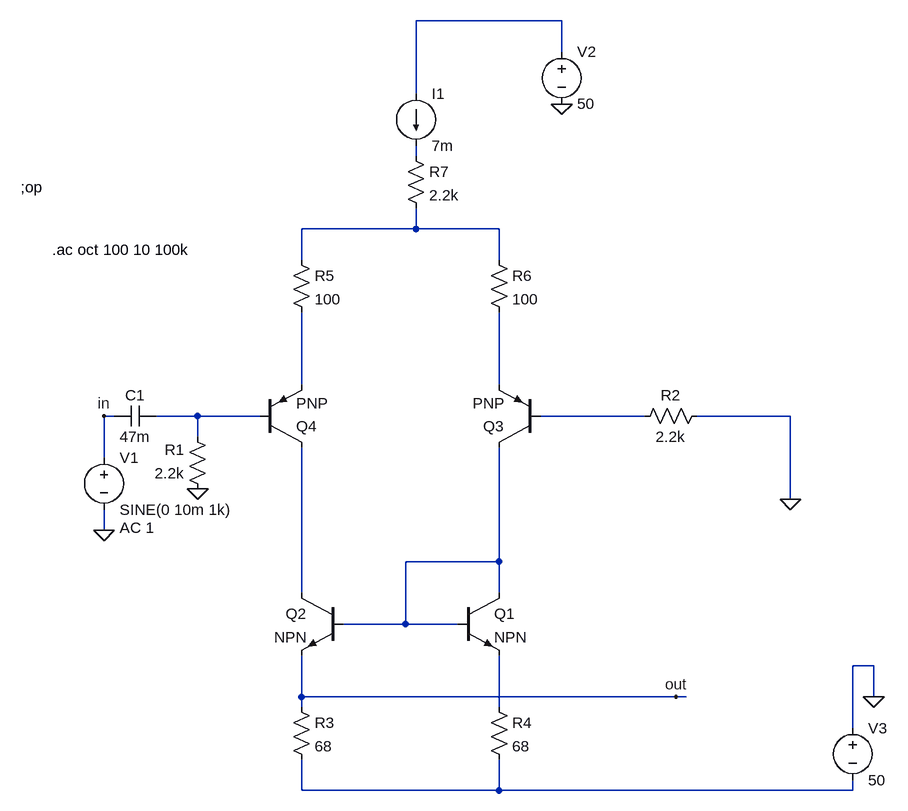
[diagram p0: schematic IPS.asc]
IPS.asc, the LTspice schematic file:
Version 4
SHEET 1 880 680
WIRE 352 -704 128 -704
WIRE 352 -656 352 -704
WIRE 128 -592 128 -704
WIRE 128 -496 128 -512
WIRE 128 -384 128 -416
WIRE 128 -384 -48 -384
WIRE 256 -384 128 -384
WIRE -48 -336 -48 -384
WIRE 256 -336 256 -384
WIRE -48 -144 -48 -256
WIRE 256 -144 256 -256
WIRE -336 -96 -352 -96
WIRE -208 -96 -272 -96
WIRE -112 -96 -208 -96
WIRE 480 -96 320 -96
WIRE 704 -96 560 -96
WIRE -208 -64 -208 -96
WIRE -352 -32 -352 -96
WIRE 704 32 704 -96
WIRE -352 80 -352 48
WIRE 256 128 256 -48
WIRE 256 128 112 128
WIRE -48 176 -48 -48
WIRE 256 176 256 128
WIRE 112 224 112 128
WIRE 112 224 16 224
WIRE 192 224 112 224
WIRE 832 288 800 288
WIRE -48 336 -48 272
WIRE 528 336 -48 336
WIRE 544 336 528 336
WIRE 832 336 832 288
WIRE -48 352 -48 336
WIRE 256 352 256 272
WIRE 800 384 800 288
WIRE -48 480 -48 432
WIRE 256 480 256 432
WIRE 256 480 -48 480
WIRE 800 480 800 464
WIRE 800 480 256 480
FLAG -352 80 0
FLAG 352 -576 0
FLAG 832 336 0
FLAG 704 32 0
FLAG -208 16 0
FLAG 528 336 out
FLAG -352 -96 in
SYMBOL npn 192 176 R0
SYMATTR InstName Q1
SYMBOL npn 16 176 M0
SYMATTR InstName Q2
SYMBOL res 576 -112 R90
WINDOW 0 0 56 VBottom 2
WINDOW 3 32 56 VTop 2
SYMATTR InstName R2
SYMATTR Value 2.2k
SYMBOL res -64 336 R0
SYMATTR InstName R3
SYMATTR Value 68
SYMBOL res 240 336 R0
SYMATTR InstName R4
SYMATTR Value 68
SYMBOL res -64 -352 R0
SYMATTR InstName R5
SYMATTR Value 100
SYMBOL res 240 -352 R0
SYMATTR InstName R6
SYMATTR Value 100
SYMBOL voltage -352 -48 R0
WINDOW 123 24 124 Left 2
WINDOW 39 0 0 Left 2
SYMATTR Value2 AC 1
SYMATTR InstName V1
SYMATTR Value SINE(0 10m 1k)
SYMBOL res 112 -512 R0
SYMATTR InstName R7
SYMATTR Value 2.2k
SYMBOL current 128 -592 R0
SYMATTR InstName I1
SYMATTR Value 7m
SYMBOL voltage 352 -672 R0
SYMATTR InstName V2
SYMATTR Value 50
SYMBOL voltage 800 368 R0
SYMATTR InstName V3
SYMATTR Value 50
SYMBOL res -192 32 R180
WINDOW 0 36 76 Left 2
WINDOW 3 36 40 Left 2
SYMATTR InstName R1
SYMATTR Value 2.2k
SYMBOL pnp 320 -48 R180
SYMATTR InstName Q3
SYMBOL pnp -112 -48 M180
SYMATTR InstName Q4
SYMBOL cap -272 -112 R90
WINDOW 0 0 32 VBottom 2
WINDOW 3 32 32 VTop 2
SYMATTR InstName C1
SYMATTR Value 47m
TEXT -480 -448 Left 2 !;op
TEXT -432 -352 Left 2 !.ac oct 100 10 100k

The netlist it stands for:
* IPS.asc
Q1 N008 N008 N010 0 NPN
Q2 N009 N008 out 0 NPN
R2 0 N007 2.2k
R3 out N011 68
R4 N010 N011 68
R5 N003 N004 100
R6 N003 N005 100
V1 in 0 SINE(0 10m 1k) AC 1
R7 N002 N003 2.2k
I1 N001 N002 7m
V2 N001 0 50
V3 0 N011 50
R1 0 N006 2.2k
Q3 N008 N007 N005 0 PNP
Q4 N009 N006 N004 0 PNP
C1 N006 in 47m
.model NPN NPN
.model PNP PNP
.lib standard.bjt
;op
.ac oct 100 10 100k
.backanno
.end